# Altium schematic sheet VoltageScaling.SchDoc
size A4; SheetNumber: 2; SheetTotal: 4
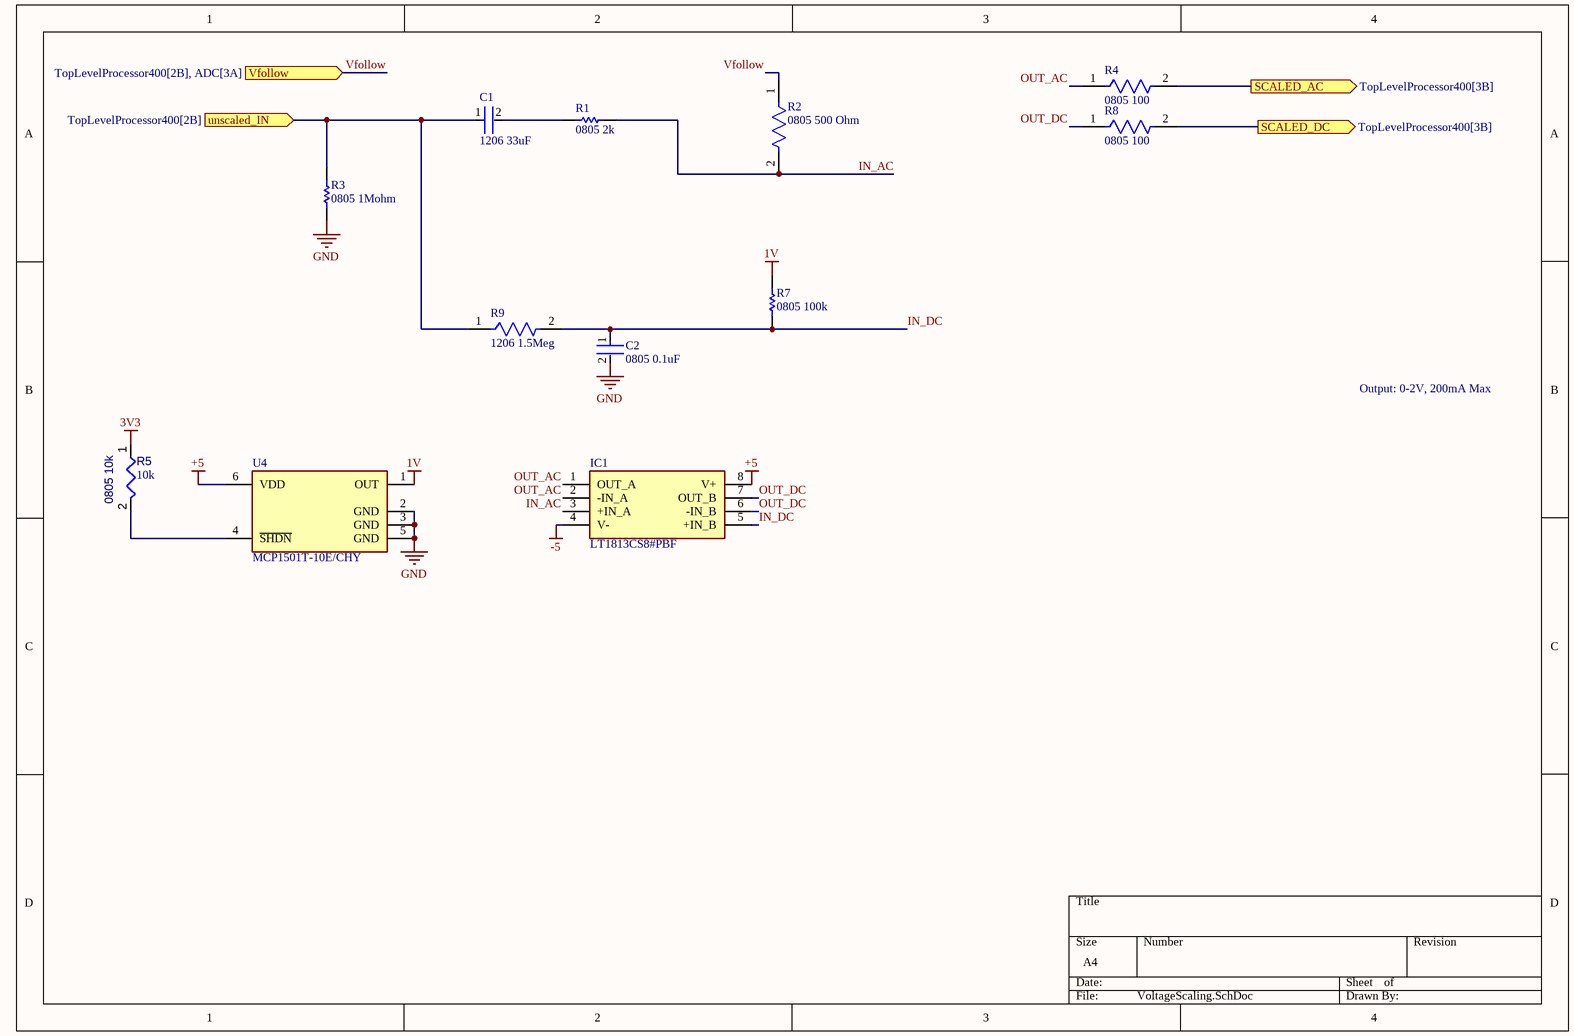
[diagram p0: VoltageScaling.SchDoc]

## Parts
C1  1206 33uF  [FP-C3216-160-0_2-IPC_A]
C2  0805 0.1uF  [FP-0805B-IPC_C]
IC1  LT1813CS8#PBF  [SOIC127P599X175-8N]
R1  0805 2k  [RESC2013X60X30ML20T20]
R2  0805 500 Ohm  [FP-RNCF0805-MFG]
R3  0805 1Mohm  [RESC2013X50X30LL20T20]
R4  0805 100  [FP-TNPW0805-e3-MFG]
R5  0805 10k  value 10k  [RESC2013X50X35ML15T15]
R7  0805 100k  [RESC2013X60X30LL20T20]
R8  0805 100  [FP-TNPW0805-e3-MFG]
R9  1206 1.5Meg  [FP-MCR18-MFG]
U4  MCP1501T-10E/CHY  [FP-C04-028-IPC_C]

## Ports
SCALED_AC (out, see TopLevelProcessor400[3B]), SCALED_DC (out, see TopLevelProcessor400[3B]), unscaled_IN (in, see TopLevelProcessor400[2B]), Vfollow (in, see TopLevelProcessor400[2B], ADC[3A])

## Nets
1V: R7.1 U4.1(OUT)
3V3: R5.1
+5: IC1.8(V+) U4.6(VDD)
-5: IC1.4(V-)
GND: C2.2 R3.2 U4.2(GND) U4.3(GND) U4.5(GND)
IN_AC: IC1.3(+IN_A) R1.2 R2.2
IN_DC: C2.1 IC1.5(+IN_B) R7.2 R9.2
OUT_AC: IC1.1(OUT_A) IC1.2(-IN_A) R4.1
OUT_DC: IC1.6(-IN_B) IC1.7(OUT_B) R8.1
SCALED_AC: R4.2 ; port SCALED_AC
SCALED_DC: R8.2 ; port SCALED_DC
unscaled_IN: C1.1 R3.1 R9.1 ; port unscaled_IN
Vfollow: R2.1 ; port Vfollow
NetC1_2: C1.2 R1.1
NetR5_2: R5.2 U4.4(~{SHDN})

## Notes on the sheet
- Output: 0-2V, 200mA Max

## Library data of the parts
C1 = CMP-08246-002728-1: Multilayer Ceramic Capacitors 33uF ±20% 25V X5R SMD 1206  C3216X5R1E336M160AC; Dielectric Material: Ceramic; Case Code (Imperial): 1206; Case Code (Metric): 3216; Max Operating Temperature: 85°C; Width: 0.063inch; Series: C; Case/Package: 1206; Lead Free: Lead Free; Voltage Rating: 25V; Voltage Rating (DC): 25V; Thickness: 1.6mm; Packaging: Tape and Reel; Mount: Surface Mount; Capacitance: 33uF; REACH SVHC: No SVHC; Length: 3.2mm; Min Operating Temperature: -55°C; Package Quantity: 1; RoHS Compliant: Yes; Resistor Type: Ceramic; Dielectric: X5R; Depth: 1.6mm; Termination: SMD/SMT; Tolerance: 20%; Weight: 0.000571oz
C2 = CMP-45632-000003-1: CAP CER 0.1UF 50V X7R 0805     0805B104K500CT; Capacitance: 100nF; Tolerance: 10%; RoHS Compliant: Yes; Packaging: Tape and Reel; Voltage Rating (DC): 50V; Voltage Rating: 50V; Length: 2mm; Lead Free: Lead Free; Voltage: 50V; Case/Package: 0805; Case Code (Metric): 2012; Depth: 1.25mm; Min Operating Temperature: -55°C; Case Code (Imperial): 0805; Max Operating Temperature: 125°C; Radiation Hardening: No; Dielectric: X7R
IC1 = LT1813CS8#PBF: Integrated Circuit; Manufacturer_Name: Analog Devices; Datasheet Link: https://www.analog.com/media/en/technical-documentation/data-sheets/18134fa.pdf; Height: 1.752mm; Manufacturer_Part_Number: LT1813CS8#PBF; Mouser Part Number: 584-LT1813CS8#PBF; Mouser Price/Stock: https://www.mouser.co.uk/ProductDetail/Analog-Devices/LT1813CS8PBF?qs=ytflclh7QUVE2rX4b3OP3g%3D%3D; Arrow Part Number: LT1813CS8#PBF; Arrow Price/Stock: https://www.arrow.com/en/products/lt1813cs8pbf/analog-devices
R1 = CMP-2001-01798-1: RK73B2ATTD202J; Manufacturer: KOA Speer; Part Number: RK73B2ATTD202J
R2 = CMP-00347-25743669-1: RNCF0805TKY500R RNCF Precision Thin Film Chip Resistor 0805 Size 500 Ohm 0.01% 0.125 W 5 ppm/°C 2-Pin SMD T/R; Voltage Rating: 150V; Power Rating: 125mW; Resistance: 500Ω; Max Operating Temperature: 155°C; Composition: Thin Film; Min Operating Temperature: -55°C; Temperature Coefficient: 5ppm/°C; Case/Package: 0805; NexarPartId: 25743669; Mount: Surface Mount; Height: 650µm; Tolerance: 0.01%; RoHS: Non-Compliant
R3 = CMP-2001-03632-1: CRCW08051M00JNEA; Manufacturer: Vishay Dale; Part Number: CRCW08051M00JNEA
R4 R8 = CMP-02407-011566-1: RES 100 OHM 0.1% 1/8W 0805    TNPW0805100RBYEN; RoHS Compliant: Yes
R5 = CMP-009-00018-5: Chip Resistor, 10 KOhm, +/- 1%, 125 mW, -55 to 155 degC, 0805 (2012 Metric); Power: 125mW; Voltage Rating: 150V; Tolerance: 1%; Pins: 2; Min Operating Temperature: -55°C; Case/Package: 0805; Max Operating Temperature: 155°C; RoHS Compliant: True; Mounting Technology: SM
R7 = CMP-2001-02684-1: 100k 0805    SG73S2ATTD1003F; Manufacturer: KOA Speer; Part Number: SG73S2ATTD1003F
R9 = CMP-08839-018795-1: Thick Film Chip Resistor, 1206, 1.5MΩ, 5%, 200ppm/°C, 0.25W, 200V   MCR18FZHJ155; Resistance: 1.5MR; Tolerance: 5%; RoHS Compliant: Yes
U4 = CMP-06323-000005-1: IC VREF SERIES 0.1% SOT23-6; Operating Supply Current: 550uA; Output Current: 20mA; Temperature Coefficient: 50ppm/°C; Min Output Voltage: 1.024V; Output Type: Fixed; Min Operating Temperature: -40°C; Reference Type: Series; Tolerance: 0.1%; Case/Package: SOT-23-6; RoHS Compliant: Yes; Max Operating Temperature: 125°C; Packaging: Tape and Reel; Mount: Surface Mount